# EAGLE schematic mrone (EAGLE 5.10)
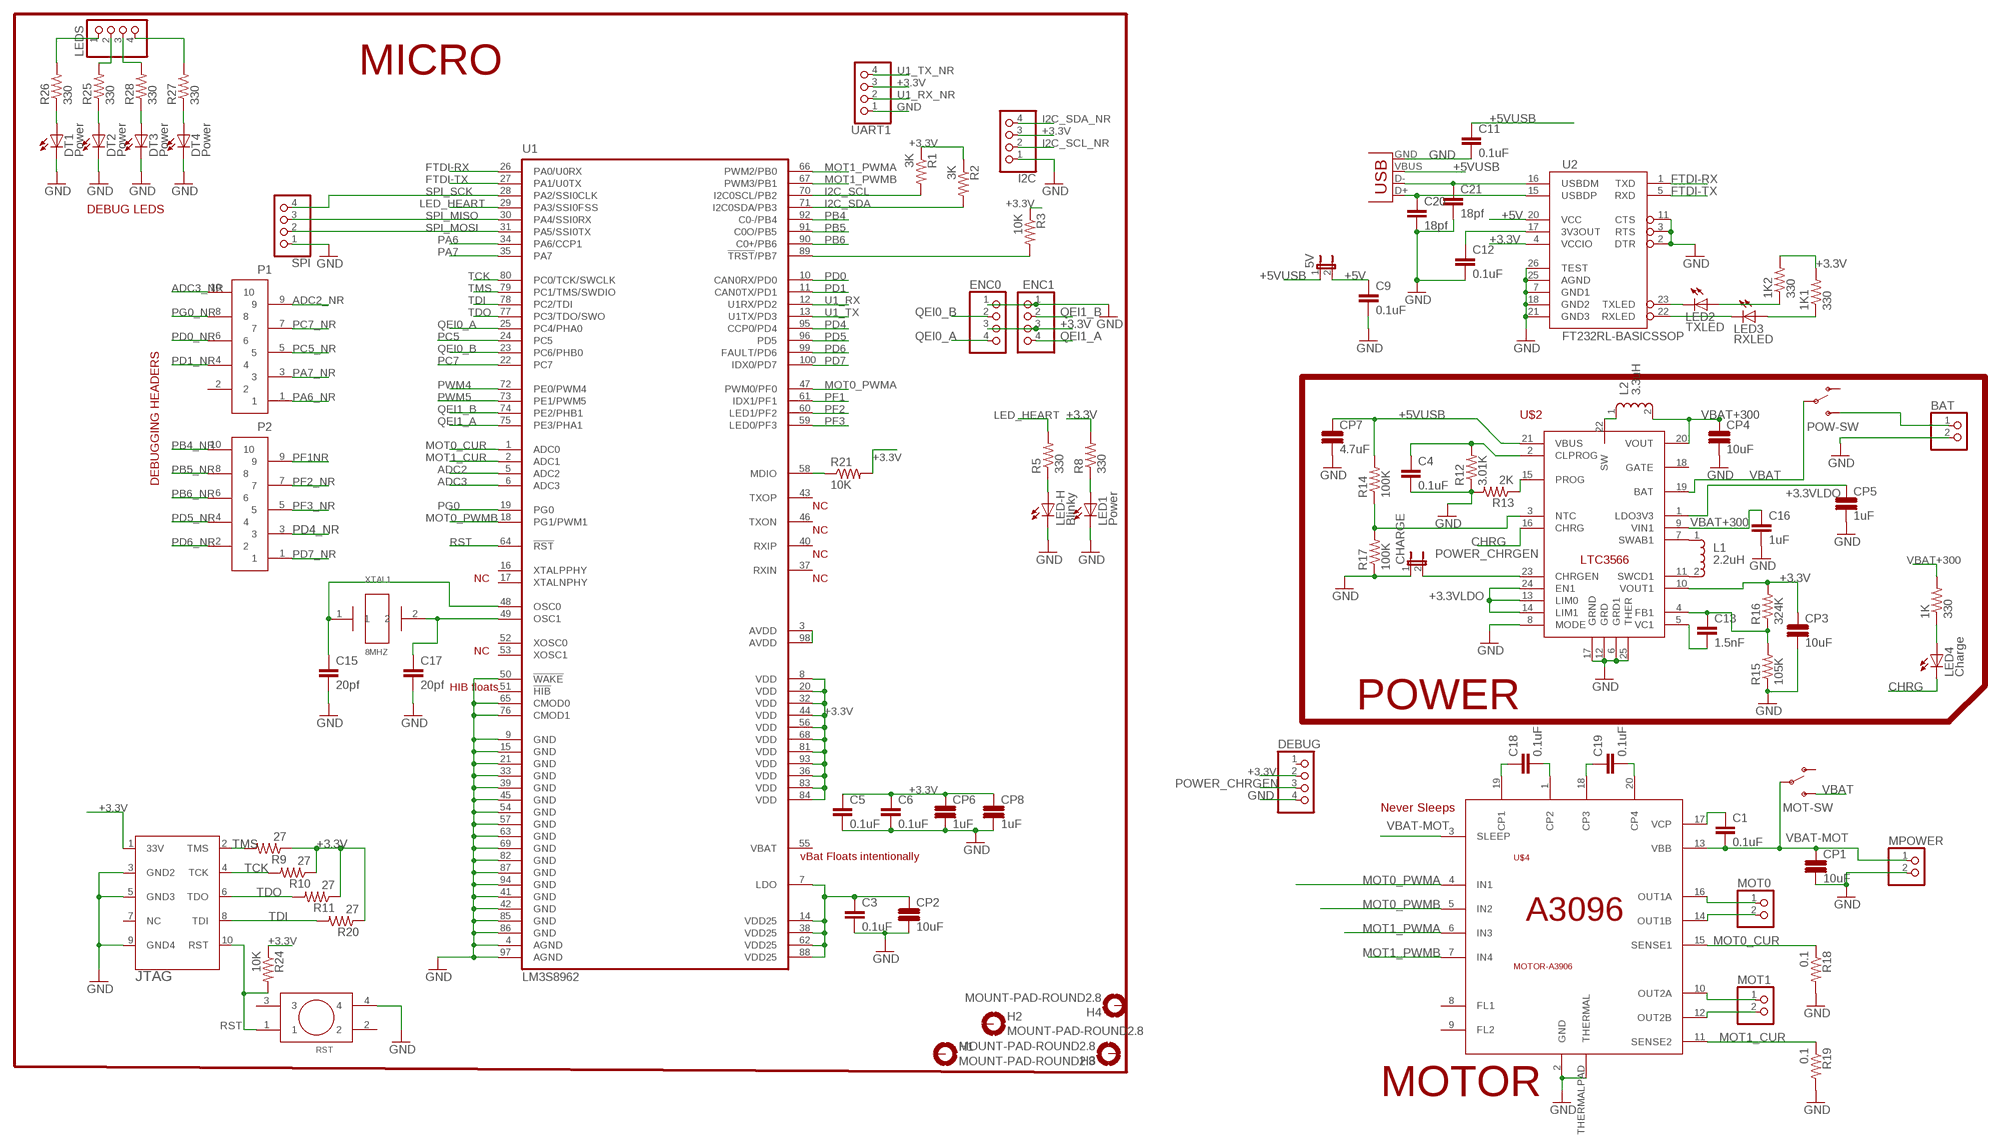
[diagram p0: schematic, sheet 1]

## Parts
1K  330  RESISTOR0603-RES  [0603-RES]
1K1  330  RESISTOR0603-RES  [0603-RES]
1K2  330  RESISTOR0603-RES  [0603-RES]
5V  JUMPER-2PTH  [1X02]
BAT  PINHD-1X2  [1X02]
C1  0.1uF  CAP0402-CAP  [0402-CAP]
C3  0.1uF  CAP0402-CAP  [0402-CAP]
C4  0.1uF  CAP0402-CAP  [0402-CAP]
C5  0.1uF  CAP0402-CAP  [0402-CAP]
C6  0.1uF  CAP0402-CAP  [0402-CAP]
C9  0.1uF  CAP0402-CAP  [0402-CAP]
C11  0.1uF  CAP0402-CAP  [0402-CAP]
C12  0.1uF  CAP0402-CAP  [0402-CAP]
C13  1.5nF  CAP0402-CAP  [0402-CAP]
C15  20pf  CAP0402-CAP  [0402-CAP]
C16  1uF  CAP0402-CAP  [0402-CAP]
C17  20pf  CAP0402-CAP  [0402-CAP]
C18  0.1uF  CAP0402-CAP  [0402-CAP]
C19  0.1uF  CAP0402-CAP  [0402-CAP]
C20  18pf  CAP0402-CAP  [0402-CAP]
C21  18pf  CAP0402-CAP  [0402-CAP]
CHARGE  JUMPER-2PTH  [1X02]
CP1  10uF  CAP-L  [0603-CAP]
CP2  10uF  CAP-L  [0603-CAP]
CP3  10uF  CAP-L  [0603-CAP]
CP4  10uF  CAP-L  [0603-CAP]
CP5  1uF  CAP-L  [0603-CAP]
CP6  1uF  CAP-L  [0603-CAP]
CP7  4.7uF  CAP-L  [0603-CAP]
CP8  1uF  CAP-L  [0603-CAP]
DEBUG  PINHD-1X4  [1X04]
DT1  Power  LED0603  [LED-0603]
DT2  Power  LED0603  [LED-0603]
DT3  Power  LED0603  [LED-0603]
DT4  Power  LED0603  [LED-0603]
ENC0  PINHD-1X4  [1X04]
ENC1  PINHD-1X4  [1X04]
H1  MOUNT-PAD-ROUND2.8  [2,8-PAD]
H2  MOUNT-PAD-ROUND2.8  [2,8-PAD]
H3  MOUNT-PAD-ROUND2.8  [2,8-PAD]
H4  MOUNT-PAD-ROUND2.8  [2,8-PAD]
I2C  PINHD-1X4  [1X04]
JTAG  SAMTECJ-TAG  [105-01-L-D-SM-LC]
L1  2.2uH  INDUC-LPS4018LPS4018-REC  [LPS4018-REC]
L2  3.3uH  INDUC-LPS4018LPS4018-REC  [LPS4018-REC]
LED1  Power  LED0603  [LED-0603]
LED2  TXLED  LED0603  [LED-0603]
LED3  RXLED  LED0603  [LED-0603]
LED4  Charge  LED0603  [LED-0603]
LED-H  Blinky  LED0603  [LED-0603]
LEDS  PINHD-1X4  [1X04]
MOT0  PINHD-1X2  [1X02]
MOT1  PINHD-1X2/90  [1X02/90]
MOT-SW  SWITCH-SPSTPTH  [SWITCH-SPDT]
MPOWER  PINHD-1X2  [1X02]
P1  50MILHEADERS  [105-01-L-D-SM-LC]
P2  50MILHEADERS  [105-01-L-D-SM-LC]
POW-SW  SWITCH-SPSTPTH  [SWITCH-SPDT]
R1  3K  RESISTOR0603-RES  [0603-RES]
R2  3K  RESISTOR0603-RES  [0603-RES]
R3  10K  RESISTOR0603-RES  [0603-RES]
R5  330  RESISTOR0603-RES  [0603-RES]
R8  330  RESISTOR0603-RES  [0603-RES]
R9  27  R-US_R0603  [R0603]
R10  27  R-US_R0603  [R0603]
R11  27  R-US_R0603  [R0603]
R12  3.01K  RESISTOR0603-RES  [0603-RES]
R13  2K  RESISTOR0603-RES  [0603-RES]
R14  100K  RESISTOR0603-RES  [0603-RES]
R15  105K  RESISTOR0603-RES  [0603-RES]
R16  324K  RESISTOR0603-RES  [0603-RES]
R17  100K  RESISTOR0603-RES  [0603-RES]
R18  0.1  RESISTOR0603-RES  [0603-RES]
R19  0.1  RESISTOR0603-RES  [0603-RES]
R20  27  R-US_R0603  [R0603]
R21  10K  RESISTOR0603-RES  [0603-RES]
R24  10K  R-US_R0603  [R0603]
R25  330  RESISTOR0603-RES  [0603-RES]
R26  330  RESISTOR0603-RES  [0603-RES]
R27  330  RESISTOR0603-RES  [0603-RES]
R28  330  RESISTOR0603-RES  [0603-RES]
RST  PUSHBUTTONSWITCH  [EIA-481]
SPI  PINHD-1X4  [1X04]
U1  LM3S8962  [LQFP100]
U2  FT232RL-BASICSSOP  [SSOP28DB]
U$2  POWER-LTC3566  [QFN-24]
U$4  MOTOR-A3906  [QFN-20]
UART1  PINHD-1X4  [1X04]
X1  USBSMD  [USB-MINIB]
XTAL1  8MHZ  CRYSTALSSMD8MHZ  [STANDARDSMDCRYSTAL8MHZ]

## Nets
+3.3V [power]: 1K1.2 1K2.2 C5.1 C6.1 CP3.1 CP6.1 CP8.1 DEBUG.2 ENC0.3 ENC1.3 I2C.3 JTAG.1(33V) R1.1 R2.1 R3.1 R8.2 R9.1 R10.1 R11.1 R16.2 R20.1 R21.2 R24.1 U1.8(VDD) U1.20(VDD) U1.32(VDD) U1.36(VDD) U1.44(VDD) U1.56(VDD) U1.68(VDD) U1.81(VDD) U1.83(VDD) U1.84(VDD) U1.93(VDD) U2.4(VCCIO) U$2.10(VOUT1) UART1.3
+3.3VLDO: CP5.1 U$2.1(LDO3V3) U$2.13(LIM0) U$2.14(LIM1) U$2.24(EN1)
+5V: 5V.2 C9.1 U2.20(VCC)
+5VUSB [power]: 5V.1 C11.1 CP7.1 R14.2 U$2.21(VBUS) X1.VBUS
ADC2: U1.5(ADC2)
ADC2_NR: P1.9
ADC3: U1.6(ADC3)
ADC3_NR: P1.10
CHRG: LED4.C U$2.16(CHRG)
FTDI-RX: U1.26(PA0/U0RX) U2.1(TXD)
FTDI-TX: U1.27(PA1/U0TX) U2.5(RXD)
GND: BAT.2 C3.2 C4.2 C5.2 C6.2 C9.2 C11.2 C12.2 C15.2 C16.2 C17.2 C20.2 C21.2 CHARGE.1 CP1.2 CP2.2 CP3.2 CP4.2 CP5.2 CP6.2 CP7.2 CP8.2 DEBUG.4 DT1.C DT2.C DT3.C DT4.C ENC0.1 ENC1.1 I2C.1 JTAG.3(GND2) JTAG.5(GND3) JTAG.9(GND4) LED1.C LED-H.C MPOWER.2 R12.1 R13.2 R15.1 R17.1 R18.2 R19.2 RST.4 SPI.1 U1.4(AGND) U1.9(GND) U1.15(GND) U1.21(GND) U1.33(GND) U1.39(GND) U1.41(GND) U1.42(GND) U1.45(GND) U1.50(!WAKE!) U1.54(GND) U1.57(GND) U1.63(GND) U1.65(CMOD0) U1.69(GND) U1.76(CMOD1) U1.82(GND) U1.85(GND) U1.86(GND) U1.87(GND) U1.94(GND) U1.97(AGND) U2.2(DTR) U2.3(RTS) U2.7(GND1) U2.11(CTS) U2.18(GND2) U2.21(GND3) U2.25(AGND) U2.26(TEST) U$2.6(GRD1) U$2.8(MODE) U$2.12(GRD) U$2.17(GRND) U$2.25(THER) U$4.2(GND) U$4.THERMALPAD(THERMAL) UART1.1 X1.GND
I2C_SCL: R1.2 U1.70(I2C0SCL/PB2)
I2C_SCL_NR: I2C.2
I2C_SDA: R2.2 U1.71(I2C0SDA/PB3)
I2C_SDA_NR: I2C.4
LED_HEART: R5.2 U1.29(PA3/SSI0FSS)
MOT0_CUR [power]: R18.1 U1.1(ADC0) U$4.15(SENSE1)
MOT0_PWMA: U1.47(PWM0/PF0) U$4.4(IN1)
MOT0_PWMB: U1.18(PG1/PWM1) U$4.5(IN2)
MOT1_CUR [power]: R19.1 U1.2(ADC1) U$4.11(SENSE2)
MOT1_PWMA: U1.66(PWM2/PB0) U$4.6(IN3)
MOT1_PWMB: U1.67(PWM3/PB1) U$4.7(IN4)
N$1: C3.1 CP2.1 U1.7(LDO) U1.14(VDD25) U1.38(VDD25) U1.62(VDD25) U1.88(VDD25)
N$2: 1K.1 LED4.A
N$3: LED-H.A R5.1
N$4: C18.1 U$4.19(CP1)
N$5: R21.1 U1.58(MDIO)
N$6: LED1.A R8.1
N$7: R14.1 R17.2 U$2.3(NTC)
N$8: C4.1 R12.2 U$2.2(CLPROG)
N$9: C20.1 U2.15(USBDP) X1.D+
N$10: LED2.C U2.23(TXLED)
N$11: L2.1(A) U$2.22(SW)
N$12 [motors]: MOT0.1 U$4.16(OUT1A)
N$13: L1.1(A) U$2.7(SWAB1)
N$14: L1.2(E) U$2.11(SWCD1)
N$15: C13.2 U$2.5(VC1)
N$16: C13.1 R15.2 R16.1 U$2.4(FB1)
N$17: LED3.C U2.22(RXLED)
N$18 [motors]: MOT0.2 U$4.14(OUT1B)
N$19 [motors]: MOT1.2 U$4.12(OUT2B)
N$20 [motors]: MOT1.1 U$4.10(OUT2A)
N$21 [motors]: BAT.1 POW-SW.3(S)
N$23: C18.2 U$4.1(CP2)
N$24: R13.1 U$2.15(PROG)
N$26: C19.1 U$4.18(CP3)
N$27: C21.1 U2.16(USBDM) X1.D-
N$28: C19.2 U$4.20(CP4)
N$29: C1.1 U$4.17(VCP)
N$30: 1K2.1 LED2.A
N$34: 1K1.1 LED3.A
N$36: LEDS.1 R26.2
N$37: C12.1 U2.17(3V3OUT)
N$38: U1.3(AVDD) U1.98(AVDD)
N$39: C15.1 U1.48(OSC0) XTAL1.1
N$40: C17.1 U1.49(OSC1) XTAL1.2
N$41: DT2.A R25.1
N$42: DT1.A R26.1
N$43: DT4.A R27.1
N$44: DT3.A R28.1
N$45: LEDS.2 R25.2
N$46: LEDS.3 R28.2
N$47: LEDS.4 R27.2
N$56: R3.2 U1.89(!TRST!/PB7)
PA6: U1.34(PA6/CCP1)
PA6_NR: P1.1
PA7: U1.35(PA7)
PA7_NR: P1.3
PB4: U1.92(C0-/PB4)
PB4_NR: P2.10
PB5: U1.91(C0O/PB5)
PB5_NR: P2.8
PB6: U1.90(C0+/PB6)
PB6_NR: P2.6
PC5: U1.24(PC5)
PC5_NR: P1.5
PC7: U1.22(PC7)
PC7_NR: P1.7
PD0: U1.10(CAN0RX/PD0)
PD0_NR: P1.6
PD1: U1.11(CAN0TX/PD1)
PD1_NR: P1.4
PD4: U1.95(CCP0/PD4)
PD4_NR: P2.3
PD5: U1.96(PD5)
PD5_NR: P2.4
PD6: U1.99(FAULT/PD6)
PD6_NR: P2.2
PD7: U1.100(IDX0/PD7)
PD7_NR: P2.1
PF1: U1.61(IDX1/PF1)
PF1NR: P2.9
PF2: U1.60(LED1/PF2)
PF2_NR: P2.7
PF3: U1.59(LED0/PF3)
PF3_NR: P2.5
PG0: U1.19(PG0)
PG0_NR: P1.8
POWER_CHRGEN: CHARGE.2 DEBUG.3 U$2.23(CHRGEN)
PWM4: U1.72(PE0/PWM4)
PWM5: U1.73(PE1/PWM5)
QEI0_A: ENC0.4 U1.25(PC4/PHA0)
QEI0_B: ENC0.2 U1.23(PC6/PHB0)
QEI1_A: ENC1.4 U1.75(PE3/PHA1)
QEI1_B: ENC1.2 U1.74(PE2/PHB1)
RST: JTAG.10(RST) R24.2 RST.1 U1.64(!RST!)
SPI_MISO: SPI.3 U1.30(PA4/SSI0RX)
SPI_MOSI: SPI.2 U1.31(PA5/SSI0TX)
SPI_SCK: SPI.4 U1.28(PA2/SSI0CLK)
TCK: JTAG.4(TCK) R10.2 U1.80(PC0/TCK/SWCLK)
TDI: JTAG.8(TDI) R20.2 U1.78(PC2/TDI)
TDO: JTAG.6(TDO) R11.2 U1.77(PC3/TDO/SWO)
TMS: JTAG.2(TMS) R9.2 U1.79(PC1/TMS/SWDIO)
U1_RX: U1.12(U1RX/PD2)
U1_RX_NR: UART1.2
U1_TX: U1.13(U1TX/PD3)
U1_TX_NR: UART1.4
VBAT [power]: MOT-SW.3(S) POW-SW.2(P) U$2.19(BAT)
VBAT+300: 1K.2 C16.1 CP4.1 L2.2(E) U$2.9(VIN1) U$2.20(VOUT)
VBAT-MOT: C1.2 CP1.1 MOT-SW.2(P) MPOWER.1 U$4.3(SLEEP) U$4.13(VBB)
Unconnected: DEBUG.1 H1.B2,8(MOUNT) H2.B2,8(MOUNT) H3.B2,8(MOUNT) H4.B2,8(MOUNT) JTAG.7(NC) MOT-SW.1(O) P1.2 POW-SW.1(O) RST.2 RST.3 U1.16(XTALPPHY) U1.17(XTALNPHY) U1.37(RXIN) U1.40(RXIP) U1.43(TXOP) U1.46(TXON) U1.51(!HIB!) U1.52(XOSC0) U1.53(XOSC1) U1.55(VBAT) U$2.18(GATE) U$4.8(FL1) U$4.9(FL2)

## Notes on the sheet
- MICRO
- DEBUG LEDS
- DEBUGGING HEADERS
- NC
- NC
- NC
- NC | NC
- NC
- HIB floats
- POWER
- Never Sleeps
- vBat Floats intentionally
- MOTOR

## Library data of the parts
1K 1K1 1K2 R1-R3 R5 R8 R12-R19 R21 R25-R28 = SparkFun:RESISTOR: Resistor Basic schematic elements and footprints for 0603, 1206, and PTH 1/10th watt (small) resistors.
5V CHARGE = SparkFun:JUMPER-2: Jumper Basic 0.1" spaced jumper. Use with breakaway headers.
BAT MOT0 MOT1 MPOWER = pinhead:PINHD-1X2: PIN HEADER
C1 C3-C6 C9 C11-C13 C15-C21 = SparkFun:CAP: Capacitor Standard 0603 ceramic capacitor, and 0.1" leaded capacitor.
CP1-CP8 = mrone:CAP-L
DEBUG ENC0 ENC1 I2C LEDS SPI UART1 = pinhead:PINHD-1X4: PIN HEADER
DT1-DT4 LED1-LED4 LED-H = SparkFun:LED: LEDs Standard schematic elements and footprints for 5mm, 3mm, 1206, and 0603 sized LEDs. 5mm - Spark Fun Electronics SKU : COM-00529 (and others)
H1-H4 = holes:MOUNT-PAD-ROUND: MOUNTING PAD, round
JTAG = mrone:SAMTECJ-TAG
L1 L2 = mrone:INDUC-LPS4018
MOT-SW POW-SW = SparkFun:SWITCH-SPST: SPST Switch Simple slide switch. Spark Fun Electronics SKU : COM-00102
P1 P2 = mrone:50MILHEADERS
R9-R11 R20 R24 = resistor:R-US_: RESISTOR, American symbol
RST = mrone:PUSHBUTTONSWITCH
U1 = luminary-arm:LM3S8962: MICROCONTROLLER
U2 = SparkFun:FT232RL-BASIC: USB UART This is the simplified version of the FT232RL unit. Only what you need, nothing you don't. Spark Fun Electronics SKU : COM-00650
U$2 = mrone:POWER-LTC3566
U$4 = mrone:MOTOR-A3906
X1 = SparkFun:USB: USB Connectors USB-B-PTH is fully proven SKU : PRT-00139 USB-miniB is fully proven SKU : PRT-00587 USB-A-PCB is untested. USB-A-H is throughly reviewed, but untested. Spark Fun Electronics SKU : PRT-00437 USB-B-SMT is throughly reviewed, but untested. Needs silkscreen touching up. USB-A-S has not been used/tested USB-MB-H has not been used/tested
XTAL1 = mrone:CRYSTALSSMD8MHZ

## Net classes
0 default: width 0.203 mm, drill 0.203 mm, clearance 0.203 mm
1 motors: width 0.457 mm, drill 0.203 mm, clearance 0.203 mm
2 power: width 0.279 mm, drill 0.203 mm, clearance 0.203 mm